# EAGLE design Crutch_light_Switch_v1p01 (EAGLE 9.6.2)
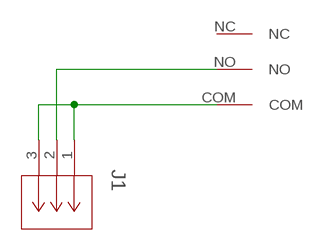
[diagram p0: schematic, sheet 1]

## Parts
J1  CONN_530470310_PICOBLADE_X_3  [CON_530470310_MOL]
U$1  LIMIT_SWITCH_D2HW-BR201DR  [LIMIT_SWITCH_D2HW-BR201DR]

## Nets
N$1: J1.1 J1.3 U$1.COM
N$2: J1.2 U$1.NO
Unconnected: U$1.NC

## Library data of the parts
J1 = 3D_MIG_Controller:CONN_530470310_PICOBLADE_X_3; COPYRIGHT: Copyright (C) 2022 Ultra Librarian. All rights reserved.; MFR_NAME: Molex Connector Corporation; PARTNO: 530470310
U$1 = 3D_MIG_Controller:LIMIT_SWITCH_D2HW-BR201DR

## Board
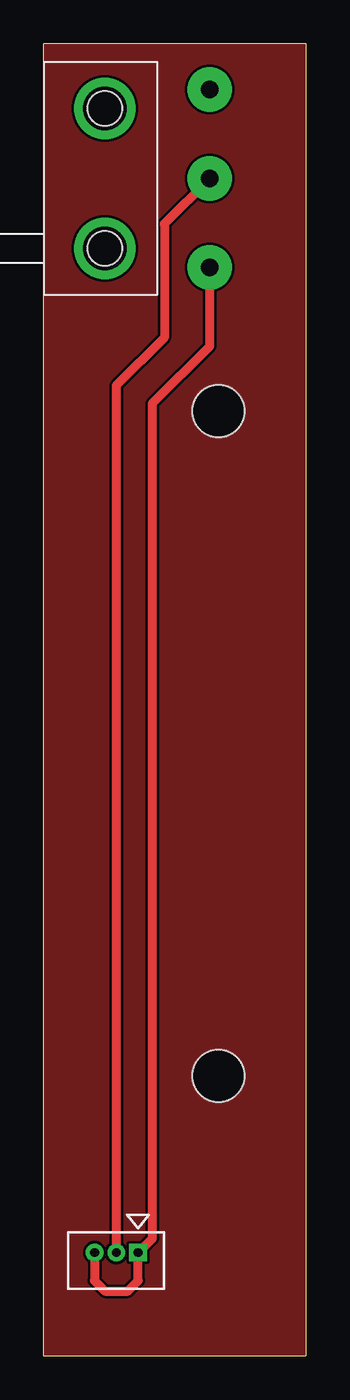
[diagram p1: board, top side]
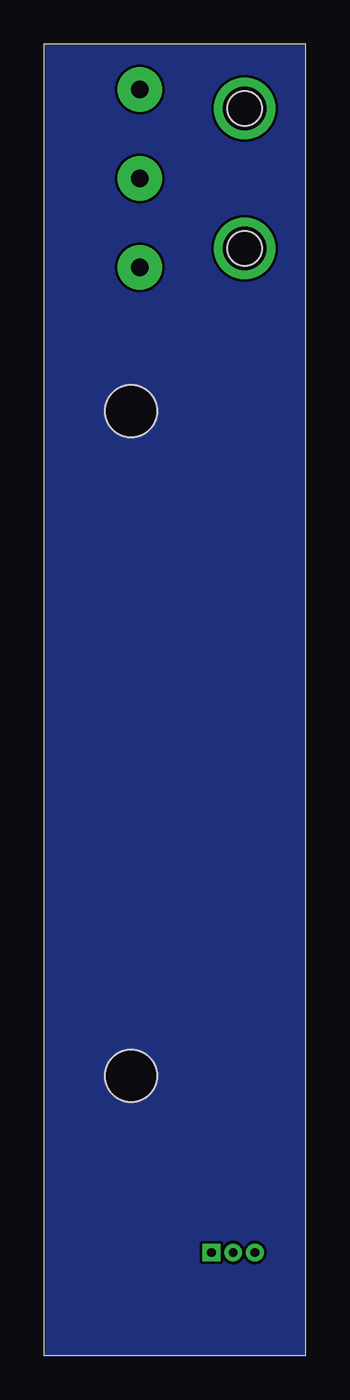
[diagram p2: board, bottom side, seen from below]

Size 15 x 75 mm. Coordinates in mm from the lower left corner, seen from the top.
Outline: 0,0 15,0 15,75 0,75 0,0
Copper layers (1*16): Top 0.035mm / dielectric 1.5mm / Bottom 0.035mm
Design rules "default *": minimum track width 6mil, minimum drill 0.35mm, track to track 6mil, track to pad 6mil, pad to pad 6mil, via to via 6mil, smd to smd 6mil, copper to edge 0mil, drill to drill 6mil, minimum pad ring 10mil, minimum via ring 8mil, stop-mask expansion 4mil, vias tented up to drill 0mil, thermal gap 10mil
Holes 3 mm at 10,54 10,16

### Footprints (pad centres in the part's own frame; a part is rotated, then mirrored left to right if it is on the bottom)
CON_530470310_MOL = drill 0.508 pad 0.838 square: 1 0,0 | drill 0.508 pad 0.838: 2 -1.245,0; 3 -2.489,0
LIMIT_SWITCH_D2HW-BR201DR = drill 1 pad 2.54: COM 3,-5.08; NC 3,5.08; NO 3,0 | drill 2.5: S1 -3,4; S2 -3,-4 | hole 1.999: -3,-4; -3,4

### Placement (x,y rotation side)
J1  5.4,5.9 0 top
U$1  6.5,67.3 0 top

### Tracks (layer width: path | path; a pad name or v marks a point on that pad's centre or on a via)
GND
  pour Bottom: 0,0 0,75 15,75 15,0
  pour Top (no thermals): 0,75 15,75 15,0 0,0
N$1
  Top 0.508: U$1.COM 9.5,57.72 6.2,54.42 6.2,6.7 J1.1 5.4,4.3 4.8,3.7 3.5,3.7 2.91,4.29 J1.3
N$2
  Top 0.508: U$1.NO 6.9,64.7 6.9,58.2 4.16,55.45 J1.2